# EAGLE design c64-stripefixvidbuf_v0.1 (EAGLE 6.0)
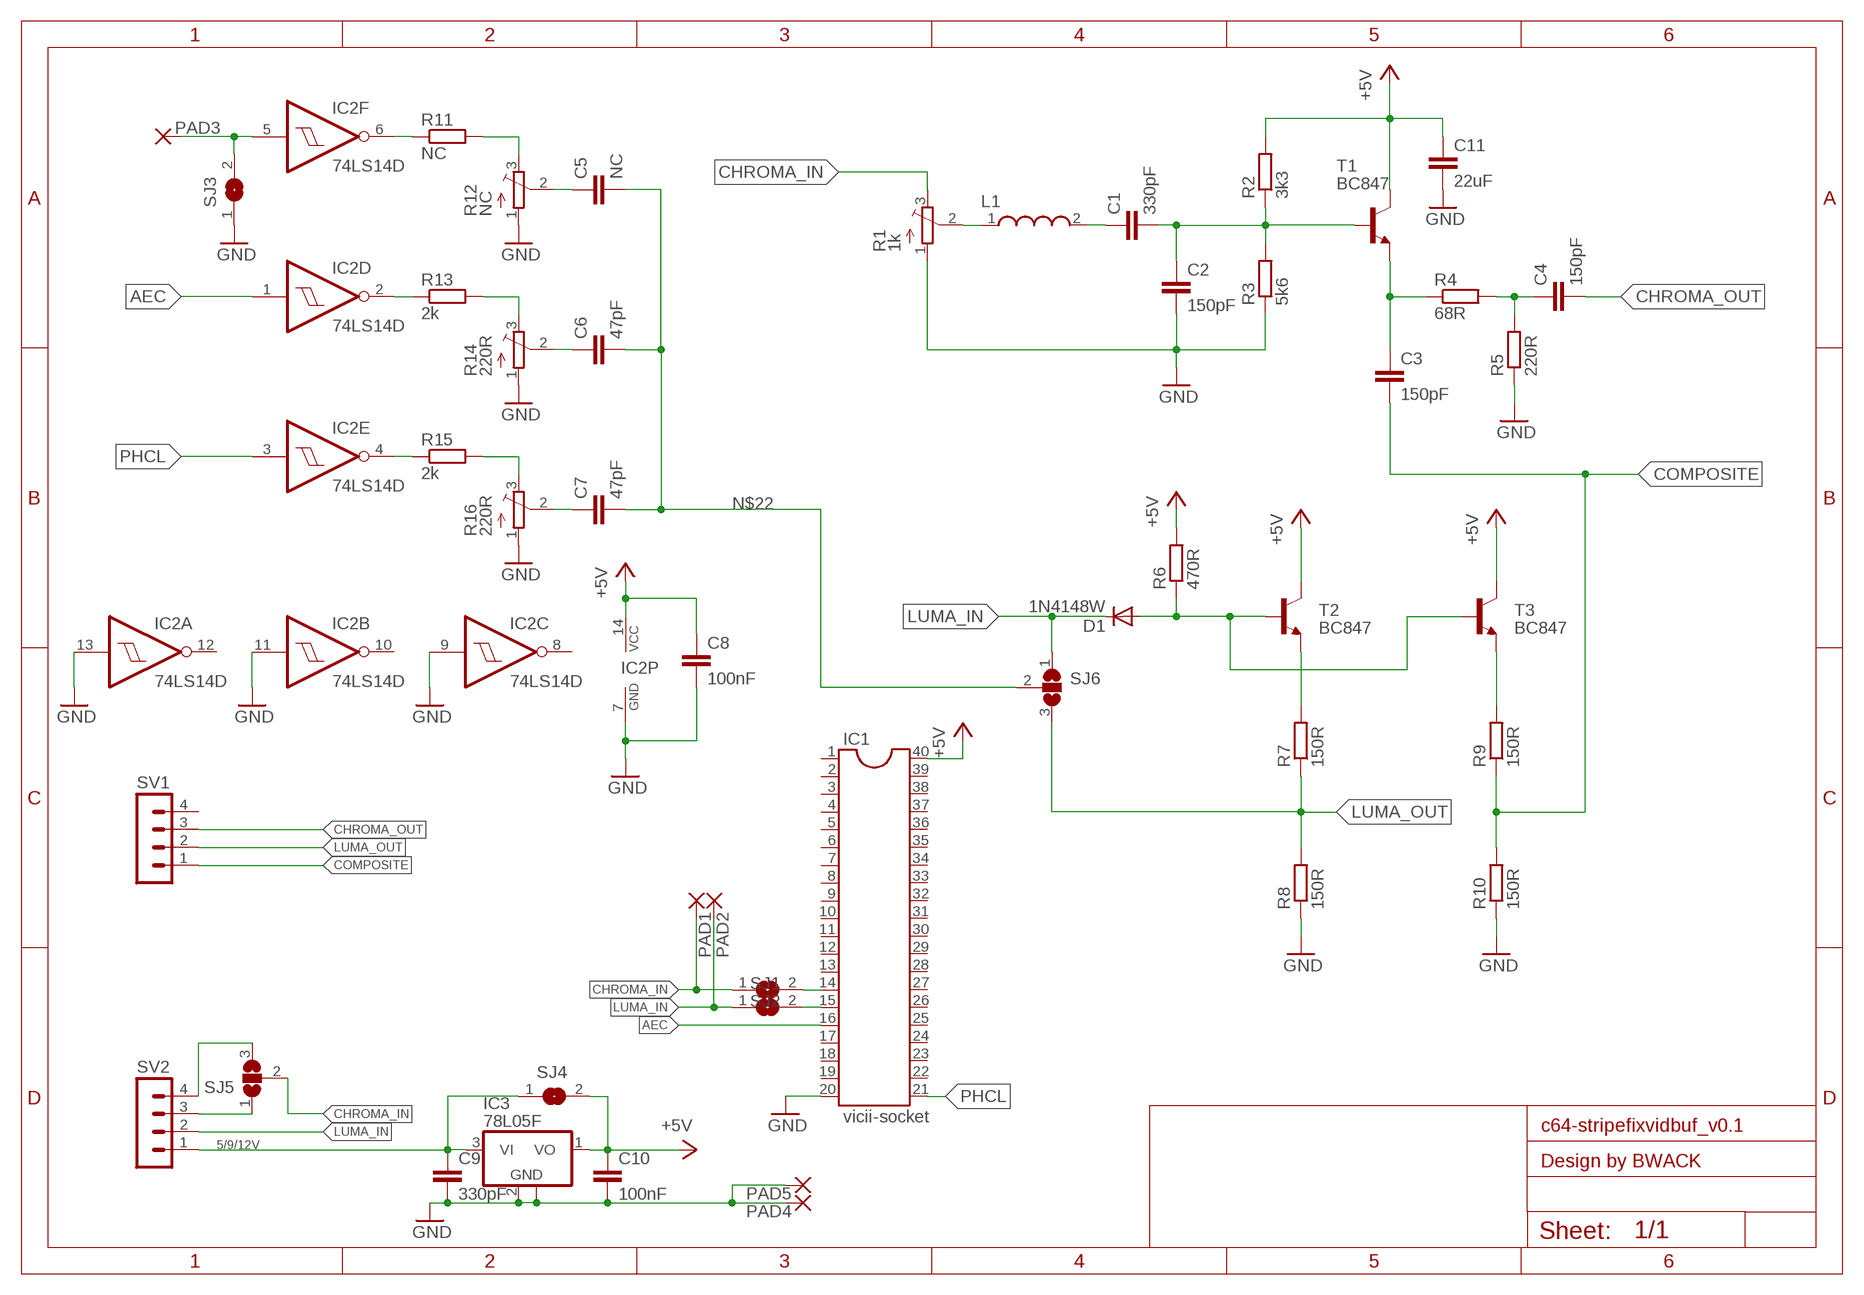
[diagram p0: schematic, sheet 1]

## Parts
C1  330pF  C-EUC0603  [C0603]
C2  150pF  C-EUC0603  [C0603]
C3  150pF  C-EUC0603  [C0603]
C4  150pF  C-EUC0603  [C0603]
C5  NC  C-EUC0603  [C0603]
C6  47pF  C-EUC0603  [C0603]
C7  47pF  C-EUC0603  [C0603]
C8  100nF  C-EUC0603  [C0603]
C9  330pF  C-EUC0603  [C0603]
C10  100nF  C-EUC0603  [C0603]
C11  22uF  C-EUC1206  [C1206]
D1  1N4148W  [SOD123]
IC1  vicii-socket  DIL40SPECIAL  [DIL40SPECIAL]
IC2  74LS14D  [SO14]
IC3  78L05F  [SOT89]
L1  WE-KIHQ_0805  [WE-KI_0805_B]
PAD1  SMD2  [SMD1,27-2,54]
PAD2  SMD2  [SMD1,27-2,54]
PAD3  SMD2  [SMD1,27-2,54]
PAD4  2,15/1,0  [2,15/1,0]
PAD5  2,15/1,0  [2,15/1,0]
R1  1k  TRIM_EU-TC33  [TC33]
R2  3k3  R-EU_R0603  [R0603]
R3  5k6  R-EU_R0603  [R0603]
R4  68R  R-EU_R0603  [R0603]
R5  220R  R-EU_R0603  [R0603]
R6  470R  R-EU_R0603  [R0603]
R7  150R  R-EU_R0603  [R0603]
R8  150R  R-EU_R0603  [R0603]
R9  150R  R-EU_R0603  [R0603]
R10  150R  R-EU_R0603  [R0603]
R11  NC  R-EU_R0603  [R0603]
R12  NC  TRIM_EU-TC33  [TC33]
R13  2k  R-EU_R0603  [R0603]
R14  220R  TRIM_EU-TC33  [TC33]
R15  2k  R-EU_R0603  [R0603]
R16  220R  TRIM_EU-TC33  [TC33]
SJ1  SJ  [SJ]
SJ2  SJ  [SJ]
SJ3  SJ  [SJ]
SJ4  SJ  [SJ]
SJ5  SJ2W  [SJ_2]
SJ6  SJ2W  [SJ_2]
SV1  MA04-1  [MA04-1]
SV2  MA04-1  [MA04-1]
T1  BC847  [SOT23]
T2  BC847  [SOT23]
T3  BC847  [SOT23]

## Nets
5/9/12V: C9.1 IC3.3(VI) SJ4.1 SV2.1
+5V: C8.1 C10.1 C11.1 IC1.40 IC2.14(P:VCC) IC3.1(VO) R2.2 R6.2 SJ4.2 T1.3(C) T2.3(C) T3.3(C)
AEC: IC1.16 IC2.1(D:I)
CHROMA_IN: PAD1.1(P) R1.3(E) SJ1.1 SJ5.2
CHROMA_OUT: C4.2 SV1.3
COMPOSITE: C3.2 R9.1 R10.2 SV1.1
GND: C2.2 C8.2 C9.2 C10.2 C11.2 IC1.20 IC2.7(P:GND) IC2.9(C:I) IC2.11(B:I) IC2.13(A:I) IC3.2(GND) IC3.2@1(GND) PAD4.1(P) PAD5.1(P) R1.1(A) R3.1 R5.1 R8.1 R10.1 R12.1(A) R14.1(A) R16.1(A) SJ3.1
LUMA_IN: D1.C PAD2.1(P) SJ2.1 SJ6.1 SV2.2
LUMA_OUT: R7.1 R8.2 SJ6.3 SV1.2
N$1: R9.2 T3.2(E)
N$2: D1.A R6.1 T2.1(B) T3.1(B)
N$3: IC1.14 SJ1.2
N$4: IC1.15 SJ2.2
N$5: SJ5.1 SV2.3
N$6: SJ5.3 SV2.4
N$7: IC2.2(D:O) R13.1
N$8: C1.1 L1.2
N$9: C1.2 C2.1 R2.1 R3.2 T1.1(B)
N$10: R13.2 R14.3(E)
N$11: C3.1 R4.1 T1.2(E)
N$12: C6.1 R14.2(S)
N$13: C7.1 R16.2(S)
N$14: R7.2 T2.2(E)
N$15: IC2.4(E:O) R15.1
N$16: L1.1 R1.2(S)
N$17: R15.2 R16.3(E)
N$18: IC2.6(F:O) R11.1
N$19: R11.2 R12.3(E)
N$20: C5.1 R12.2(S)
N$21: IC2.5(F:I) PAD3.1(P) SJ3.2
N$22: C5.2 C6.2 C7.2 SJ6.2
PHCL: IC1.21 IC2.3(E:I)
QEQWEQW: C4.1 R4.2 R5.2
Unconnected: IC1.1 IC1.2 IC1.3 IC1.4 IC1.5 IC1.6 IC1.7 IC1.8 IC1.9 IC1.10 IC1.11 IC1.12 IC1.13 IC1.17 IC1.18 IC1.19 IC1.22 IC1.23 IC1.24 IC1.25 IC1.26 IC1.27 IC1.28 IC1.29 IC1.30 IC1.31 IC1.32 IC1.33 IC1.34 IC1.35 IC1.36 IC1.37 IC1.38 IC1.39 IC2.8(C:O) IC2.10(B:O) IC2.12(A:O) SV1.4

## Notes on the sheet
- Design by BWACK

## Library data of the parts
C1-C11 = rcl:C-EU: CAPACITOR, European symbol
D1 = diode:1N4148: DIODE high speed (Philips)
IC1 = ic-package_edit:DIL40: Dual In Line
IC2 = 74xx-eu:74*14: Hex schmitt trigger INVERTER
IC3 = linear:78L*: POSITOIV-VOLTAGE REGULATORS Output up to 100 mA Source: http://focus.ti.com/lit/ds/symlink/ua78l05.pdf
L1 = Wurth_Elektronik_Passive_rev15f:WE-KIHQ: SMD Wire Wound Ceramic Inductor WE-KIHQ - High current - Highest Quality factor in size 0805 - up to 98 - High thermal stability - High SRF -- Bluetooth -- Wireless LAN -- RF oscillation circuit -- IF impedance matching -- IG choke
PAD1-PAD3 = wirepad:SMD2: SMD PAD
PAD4 PAD5 = wirepad:2,15/1,0: THROUGH-HOLE PAD
R1 R12 R14 R16 = pot:TRIM_EU-: POTENTIOMETER
R2-R11 R13 R15 = resistor:R-EU_: RESISTOR, European symbol
SJ1-SJ4 = jumper:SJ: SMD solder JUMPER
SJ5 SJ6 = jumper:SJ2W: SMD solder JUMPER
SV1 SV2 = con-lstb:MA04-1: PIN HEADER; OC_FARNELL: unknown; OC_NEWARK: unknown
T1-T3 = transistor:BC847: NPN TRANSISTOR

## Board
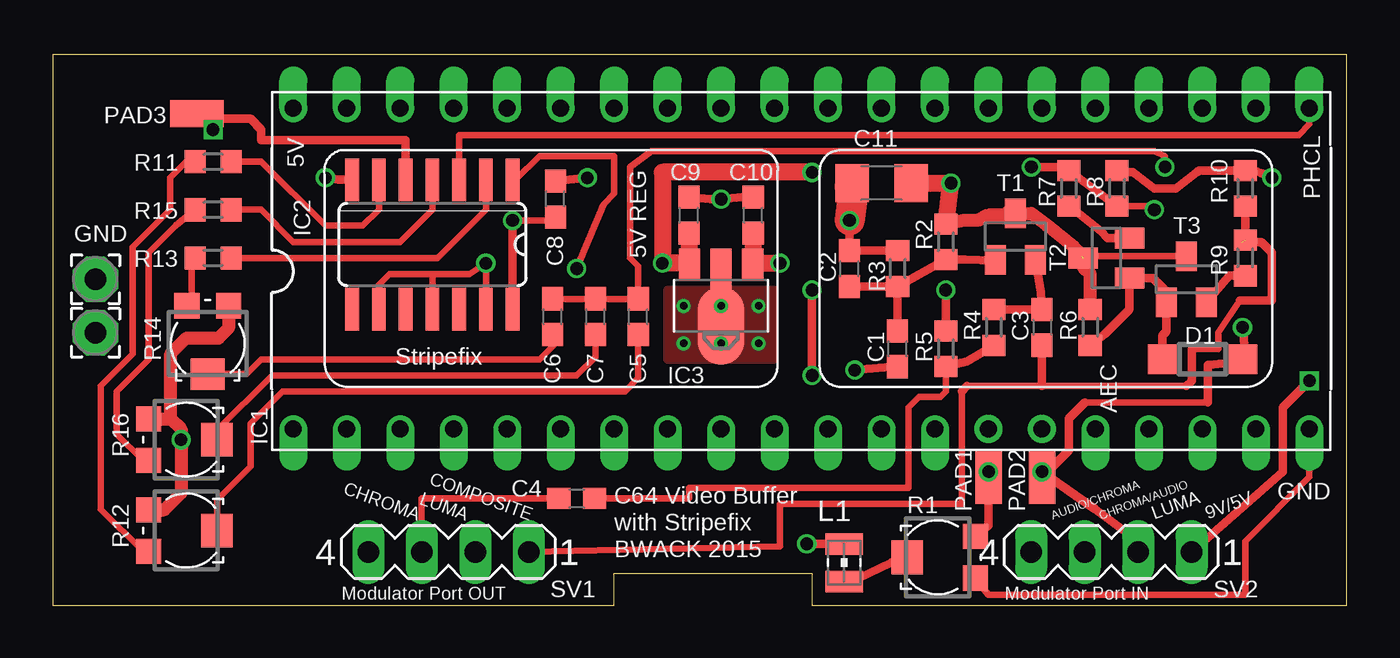
[diagram p1: board, top side]
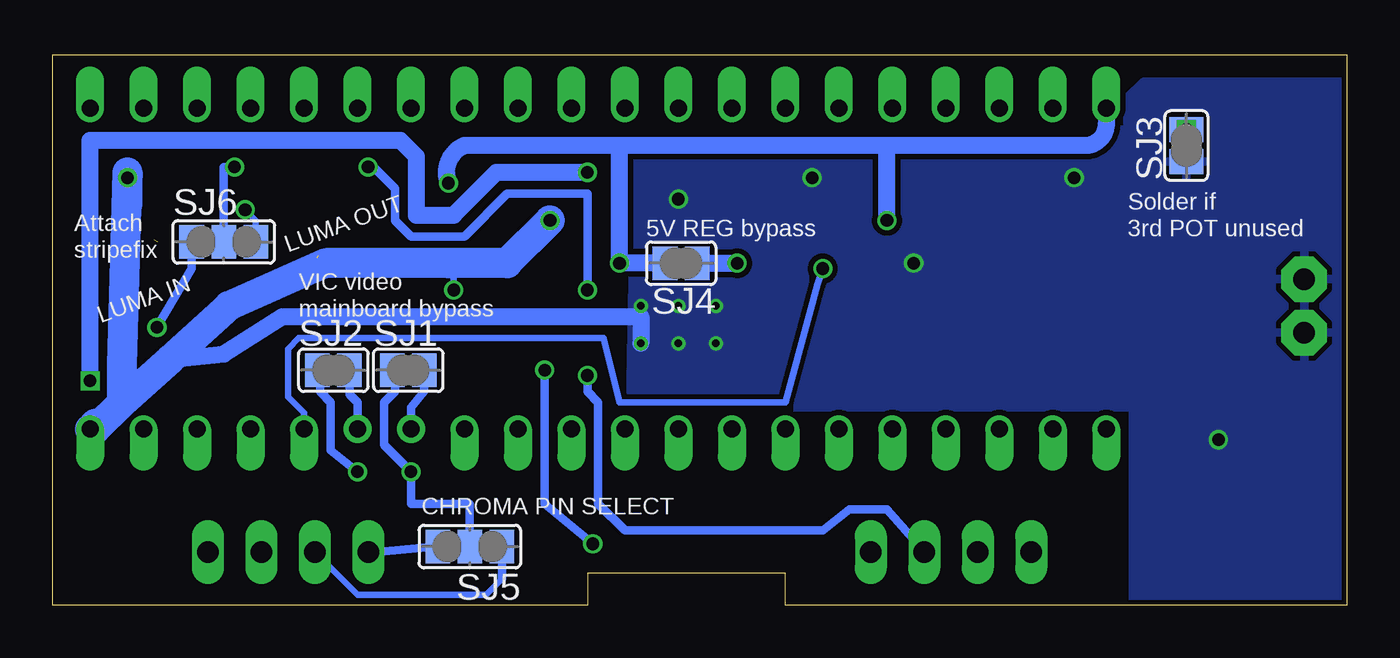
[diagram p2: board, bottom side, seen from below]

Size 61.47 x 26.16 mm. Coordinates in mm from the lower left corner, seen from the top.
Outline: 0,0 26.67,0 26.67,1.52 36.07,1.52 36.07,0 61.47,0 61.47,26.16 0,26.16 0,0
Copper layers (1*16): Top 0.035mm / dielectric 1.5mm / Bottom 0.035mm
Design rules: minimum track width 5mil, minimum drill 12mil, track to track 5mil, track to pad 5mil, pad to pad 5mil, via to via 5mil, smd to smd 0mil, copper to edge 10mil, drill to drill 10mil, minimum pad ring 10mil, minimum via ring 6mil, stop-mask expansion 2mil, vias tented up to drill 25mil, thermal gap 10mil

### Footprints (pad centres in the part's own frame; a part is rotated, then mirrored left to right if it is on the bottom)
C0603 = smd 1.1 x 1: 1 -0.85,0; 2 0.85,0
C1206 = smd 1.6 x 1.8: 1 -1.4,0; 2 1.4,0
SOD123 = smd 1.4 x 1.4: A 1.9,0; C -1.9,0
DIL40SPECIAL = drill 0.813 offset: 1 0,0; 2 2.54,0; 3 5.08,0; 4 7.62,0; 5 10.16,0; 6 12.7,0; 7 15.24,0; 8 17.78,0; 9 20.32,0; 10 22.86,0; 11 25.4,0; 12 27.94,0; 13 30.48,0; 16 38.1,0; 17 40.64,0; 18 43.18,0; 19 45.72,0; 20 48.26,0; 21 48.26,15.24; 22 45.72,15.24; 23 43.18,15.24; 24 40.64,15.24; 25 38.1,15.24; 26 35.56,15.24; 27 33.02,15.24; 28 30.48,15.24; 29 27.94,15.24; 30 25.4,15.24; 31 22.86,15.24; 32 20.32,15.24; 33 17.78,15.24; 34 15.24,15.24; 35 12.7,15.24; 36 10.16,15.24; 37 7.62,15.24; 38 5.08,15.24; 39 2.54,15.24; 40 0,15.24 | drill 0.813: 14 33.02,0; 15 35.56,0
SO14 = smd 0.66 x 2.032: 1 -3.81,-3.073; 2 -2.54,-3.073; 3 -1.27,-3.073; 4 0,-3.073; 5 1.27,-3.073; 6 2.54,-3.073; 7 3.81,-3.073; 8 3.81,3.073; 9 2.54,3.073; 10 1.27,3.073; 11 0,3.073; 12 -1.27,3.073; 13 -2.54,3.073; 14 -3.81,3.073
SOT89 = smd 1 x 1.5: 1 -1.499,-1.981; 3 1.499,-1.981 | smd 1 x 2: 2 0,-1.727 | smd 2.2 x 3.7: 2@1 0,0.94
WE-KI_0805_B = smd 1.02 x 1.78: 1 -0.89,0; 2 0.89,0
SMD1,27-2,54 = smd 1.27 x 2.54: 1 0,0
2,15/1,0 = drill 1.016 pad 2.159 octagon: 1 0,0
TC33 = smd 1.194 x 1.194: 1 -0.991,-1.791; 3 0.991,-1.791 | smd 1.6 x 1.499: 2 0,1.46
R0603 = smd 1 x 1.1: 1 -0.85,0; 2 0.85,0
SJ = smd 1.168 x 1.6: 1 -0.762,0; 2 0.762,0
SJ_2 = smd 1.168 x 1.6: 1 -1.524,0; 2 0,0; 3 1.524,0
MA04-1 = drill 1.016 long: 1 -3.81,0; 2 -1.27,0; 3 1.27,0; 4 3.81,0
SOT23 = smd 1 x 1.4: 1 -0.95,-1.1; 2 0.95,-1.1; 3 0,1.1

### Placement (x,y rotation side)
C1  40.13,12.19 90 top
C2  37.85,16 90 top
C3  46.99,13.21 270 top
C4  24.89,5.08 180 top
C5  27.81,13.72 90 top
C6  23.75,13.72 90 top
C7  25.78,13.72 90 top
C8  23.88,19.3 90 top
C9  30.23,18.54 90 top
C10  33.27,18.54 90 top
C11  39.37,20.07 180 top
D1  54.61,11.68 180 top
IC1  11.43,8.38 0 top
IC2  18.03,17.14 180 top
IC3  31.75,14.22 180 top
L1  37.59,2.03 90 top
PAD1  44.45,6.1 0 top
PAD2  46.99,6.1 0 top
PAD3  6.86,23.37 270 top
PAD4  2.03,15.49 90 top
PAD5  2.03,12.95 90 top
R1  42.04,2.29 90 top
R2  42.42,17.27 90 top
R3  40.13,16 270 top
R4  44.7,13.21 270 top
R5  42.42,12.19 270 top
R6  49.28,13.21 90 top
R7  48.26,19.81 270 top
R8  50.55,19.81 270 top
R9  56.64,16.51 270 top
R10  56.64,19.81 270 top
R11  7.62,21.08 180 top
R12  6.35,3.56 270 top
R13  7.62,16.51 180 top
R14  7.37,12.45 180 top
R15  7.62,18.8 180 top
R16  6.35,7.87 270 top
SJ1  44.58,11.18 0 bottom
SJ2  48.13,11.18 0 bottom
SJ3  7.62,21.84 90 bottom
SJ4  31.62,16.26 180 bottom
SJ5  41.66,2.79 180 bottom
SJ6  53.34,17.27 0 bottom
SV1  18.8,2.54 180 top
SV2  50.29,2.54 180 top
T1  45.72,17.53 0 top
T2  50.04,16.51 90 top
T3  53.85,15.49 0 top

### Tracks (layer width: path | path; a pad name or v marks a point on that pad's centre or on a via)
5/9/12V  (via drill 0.6)
  Top 0.406: SV2.1 58.42,6.35 58.42,9.4 v59.69,10.67 59.94,10.92
  Top 0.813: C9.1 30.23,16.2 IC3.3 30.25,16.26 v28.96,16.26 28.96,20.57 v36.07,20.57
  Bottom 0.813: SJ4.1 v28.96,16.26 | v59.69,10.67 59.69,22.1 44.96,22.1 44.2,21.34 44.2,18.54 42.42,18.54 40.39,20.57 v36.07,20.57
+5V  (via drill 0.6)  (1 unrouted)
  Top 0.305: 23.88,18.29 v21.84,18.29 | T3.3 48.85,16.59 48.77,16.51
  Top 0.406: v21.84,18.29 IC2.14 | C8.1 23.88,18.29
  Top 0.61: T1.3 46.48,18.63 47.24,18.03 48.51,17.02 48.77,16.76 48.77,16.51 | 45.72,18.8 45.47,18.8 45.21,18.54 44.45,18.54 43.94,18.29 43.27,18.29 R2.2 | T2.3 48.94,16.09 49.28,15.75 R6.2
  Top 0.813: C11.1 v42.67,20.07 R2.2 | C10.1 33.27,16.2 IC3.1 33.25,16.26 v34.54,16.26 | 45.72,18.8 T1.3
  Bottom 0.813: IC1.40 11.43,22.86 arc90 12.45,21.84 21.84,21.84 | 21.84,21.84 34.54,21.84 | 34.54,21.84 41.91,21.84 arc-90 v42.67,20.07 | v21.84,18.29 21.84,21.84 | SJ4.2 v34.54,16.26 34.54,21.84
AEC  (via drill 0.6)
  Top 0.305: v24.89,16 26.16,19.05 26.67,19.56 26.67,21.34 23.11,21.34 22,20.22 IC2.1
  Bottom 0.305: IC1.16 49.53,9.14 50.29,9.91 50.29,12.19 49.78,12.7 35.31,12.7 34.54,9.65 26.67,9.65 25.15,15.24 v24.89,16
CHROMA_IN  (via drill 0.6)
  Top 0.406: R1.3 44.45,3.79 PAD1.1 v44.45,6.35 44.45,6.86
  Bottom 0.406: SJ1.1 45.21,10.79 45.21,10.16 45.72,9.65 45.72,7.62 v44.45,6.35 44.45,4.83 41.66,4.83 SJ5.2
CHROMA_OUT
  Top 0.305: C4.2 17.53,5.08 SV1.3
COMPOSITE  (1 unrouted)
  Top 0.305: 56.39,14.48 55.37,12.95 55.37,12.19 54.1,12.19 | 53.85,10.41 46.99,10.41 43.43,10.41 | 43.18,10.16 43.18,4.83 34.54,4.83 34.54,2.79 SV1.1
  Top 0.406: 56.48,17.27 57.4,17.27 57.91,16.76 57.91,14.48 56.39,14.48 | 54.1,12.19 54.1,10.67 53.85,10.41 | C3.2 46.99,10.41 | 43.43,10.41 43.18,10.16 | R10.2 R9.1
GND  (via drill 0.36, 0.6)
  Top 0.305: IC1.20 59.69,6.1 56.64,3.05 56.64,0.51 44.45,0.51 R1.1 | IC2.13 v20.57,16.26 19.81,15.75 18.03,15.75 | IC2.11 18.03,15.75 | IC2.9 15.49,15.24 16,15.75 18.03,15.75 | 42.42,14.48 v42.42,14.99
  Top 0.406: R3.1 C2.2 v37.85,18.29 37.85,19.94 C11.2 | IC2.7 13.56,20.22 v12.95,20.32 | v25.4,20.32 C8.2 | C9.2 31.24,19.3 v31.75,19.3 32.77,19.39 C10.2 | 54.44,20.66 53.34,19.81 52.32,19.81 51.31,20.57 50.89,20.57 R8.1 | R5.1 42.42,14.48 | v57.91,20.32 arc30 R10.1 54.44,20.66 | 54.44,20.66 54.36,20.57
  Top 0.61: R12.1 5.31,4.55 6.1,5.33 v6.1,7.87 6.1,8.38 5.61,8.87 | R16.1 5.61,8.87 | 5.61,8.87 5.61,11.96 6.35,12.7 7.87,12.7 8.36,13.18 R14.1
  Top 1.422: 37.85,19.94 37.97,19.18 v37.85,18.29
  Bottom 0.305: 42.67,16.26 42.42,15.75 v42.42,14.99
  Bottom 0.813: 55.88,11.68 53.34,11.94 50.55,13.72 33.53,13.72 v33.53,12.45
  Bottom 1.422: v37.85,18.29 39.88,16.26 42.67,16.26 48.51,16.26 53.09,14.22 55.88,11.68 58.17,9.65 | 58.17,9.65 59.44,8.38 59.44,8.64 IC1.20 | 58.17,9.65 58.17,11.43 57.91,20.57 v57.91,20.32 57.91,19.05
  other vias: 29.97,12.45 29.97,14.22 31.75,14.22 31.75,12.45 33.53,14.22
  pour Top (no thermals): 29.21,11.68 29.21,14.99 34.29,14.99 34.29,11.68
  pour Bottom (isolate 0.254): 0,0 0,24.89 9.65,24.89 10.41,24.13 10.41,22.86 10.16,22.61 33.78,22.61 34.04,9.4 10.16,9.4 10.16,0
LUMA_IN  (via drill 0.6)
  Top 0.305: 54.86,9.65 49.02,9.65
  Top 0.406: 54.86,9.65 54.86,11.43 56.39,11.56 D1.C 56.64,11.82 v56.52,13.21 | 49.02,9.65 48.26,8.89 48.26,7.37 47.24,6.35 v46.99,6.35 | SV2.2 51.56,3.05 49.53,4.57 v46.99,6.35 | v46.99,6.35 PAD2.1
  Bottom 0.406: SJ6.1 54.86,16 v56.52,13.21 | SJ2.1 48.77,11.3 48.77,10.16 48.26,9.65 48.26,7.37 v46.99,6.35
LUMA_OUT  (via drill 0.6)
  Top 0.305: R8.2 52.32,18.96 v52.32,18.8
  Top 0.406: v36.07,14.99 v36.07,10.92 | R8.2 R7.1 48.09,20.83 v46.48,20.83
  Bottom 0.305: SJ6.3 51.82,18.29 v52.32,18.8
  Bottom 0.406: v46.48,20.83 46.23,20.83 45.21,19.81 45.21,18.29 44.45,17.53 41.91,17.53 39.88,19.56 36.07,19.56 v36.07,14.99 | v36.07,10.92 36.07,10.16 35.56,9.65 35.56,4.83 34.29,3.56 24.89,3.56 23.62,4.57 21.84,4.57 SV1.2
N$1
  Top 0.406: T3.2 55.88,15.66 R9.2
N$2
  Top 0.406: R6.1 49.95,12.87 51.14,14.05 T2.1 52.26,15.56 52.9,14.92 T3.1 52.9,13.02 52.71,12.83 D1.A
N$3
  Bottom 0.406: SJ1.2 43.81,10.16 44.45,9.4 IC1.14
N$4
  Bottom 0.406: IC1.15 46.99,9.65 47.37,10.03 SJ2.2
N$5
  Bottom 0.305: 40.13,1.27 40.89,0.51 46.99,0.51 SV2.3
  Bottom 0.406: SJ5.1 40.13,1.27
N$6
  Bottom 0.406: SJ5.3 45.97,2.54 SV2.4
N$7
  Top 0.305: IC2.2 20.57,18.8 18.29,16.51 R13.1
N$8  (via drill 0.6)
  Top 0.406: v38.1,11.18 40.04,11.34 C1.1 | L1.2 v35.81,2.92
  Bottom 0.406: v35.81,2.92 38.1,4.83 v38.1,11.18
N$9
  Top 0.406: C1.2 R3.2 | R3.2 C2.1 | R3.2 R2.1 43.35,16.42 44.7,16.38 44.6,16.26 T1.1
N$10
  Top 0.305: R14.3 6.6,14.24 6.6,16.51 R13.2
N$11
  Top 0.406: T1.2 46.92,14.89 C3.1 R4.1
N$12
  Top 0.305: C6.1 23.79,12.36 23.11,11.68 9.91,11.68 9.21,10.99 R14.2
N$13
  Top 0.305: R16.2 7.75,8.26 10.41,10.92 24.89,10.92 25.78,11.81 C7.1
N$14
  Top 0.406: R7.2 48.35,18.96 48.51,18.8 49.78,17.78 50.1,17.46 T2.2
N$15
  Top 0.305: IC2.4 18.03,18.8 16.51,17.27 11.43,17.27 9.91,18.8 R15.1
N$16
  Top 0.406: R1.2 39.81,2.03 38.23,1.27 L1.1
N$17
  Top 0.305: R16.3 4.29,6.88 3.05,8.13 3.05,10.16 4.57,11.68 4.57,16.76 5.84,18.03 R15.2
N$18
  Top 0.305: IC2.6 15.49,18.8 14.73,18.03 12.95,18.03 9.91,21.08 R11.1
N$19
  Top 0.305: R12.3 4.29,2.56 2.29,4.57 2.29,10.41 3.81,11.94 3.81,17.02 5.59,18.8 5.59,20.32 6.35,21.08 R11.2
N$20
  Top 0.305: R12.2 7.81,5.02 9.4,6.6 9.4,8.64 10.92,10.16 27.18,10.16 27.81,10.79 C5.1
N$21  (via drill 0.6)
  Top 0.406: IC2.5 16.76,22.1 9.91,22.1 9.91,22.61 9.4,23.11 7.87,23.11 SJ3.2 PAD3.1
  other vias: 7.62,22.61
N$22  (via drill 0.6)
  Top 0.305: v52.83,20.83 52.83,21.34 52.32,21.59 28.45,21.59 27.43,20.83 27.43,16.51 27.81,16.13 C5.2 C7.2 C6.2
  Bottom 0.406: v52.83,20.83 53.34,20.83 SJ6.2
PHCL
  Top 0.305: IC1.21 59.69,22.86 59.18,22.35 19.3,22.35 IC2.3
  Top 0.406: 19.3,20.07 IC2.3
QEQWEQW
  Top 0.305: R5.2 42.42,10.16 42.16,9.91 41.15,9.91 40.64,9.4 40.64,5.59 30.23,5.59 30.23,5.08 C4.1
  Top 0.406: R5.2 43.43,11.6 R4.2

### Text on the board
tPlace: 5V | GND | 5V REG | Stripefix | GND | CHROMA | LUMA | COMPOSITE | C64 Video Buffer | with Stripefix | AUDIO/CHROMA | CHROMA/AUDIO | LUMA | 9V/5V | BWACK 2015 | Modulator Port OUT | Modulator Port IN
bPlace: Solder if | 3rd POT unused | 5V REG bypass | Attach | LUMA OUT | stripefix | LUMA IN | VIC video | mainboard bypass | CHROMA PIN SELECT
tNames: PHCL | AEC